# Altium schematic sheet GPSR_Peripheral.SchDoc: GPSR Front-End Board
size A3; CompanyName: NYCU; DocumentNumber: GPSR : Peripheral; Revision: v3.0; SheetNumber: 2; SheetTotal: 2; RevisionBy: Cheng-Chun Huang
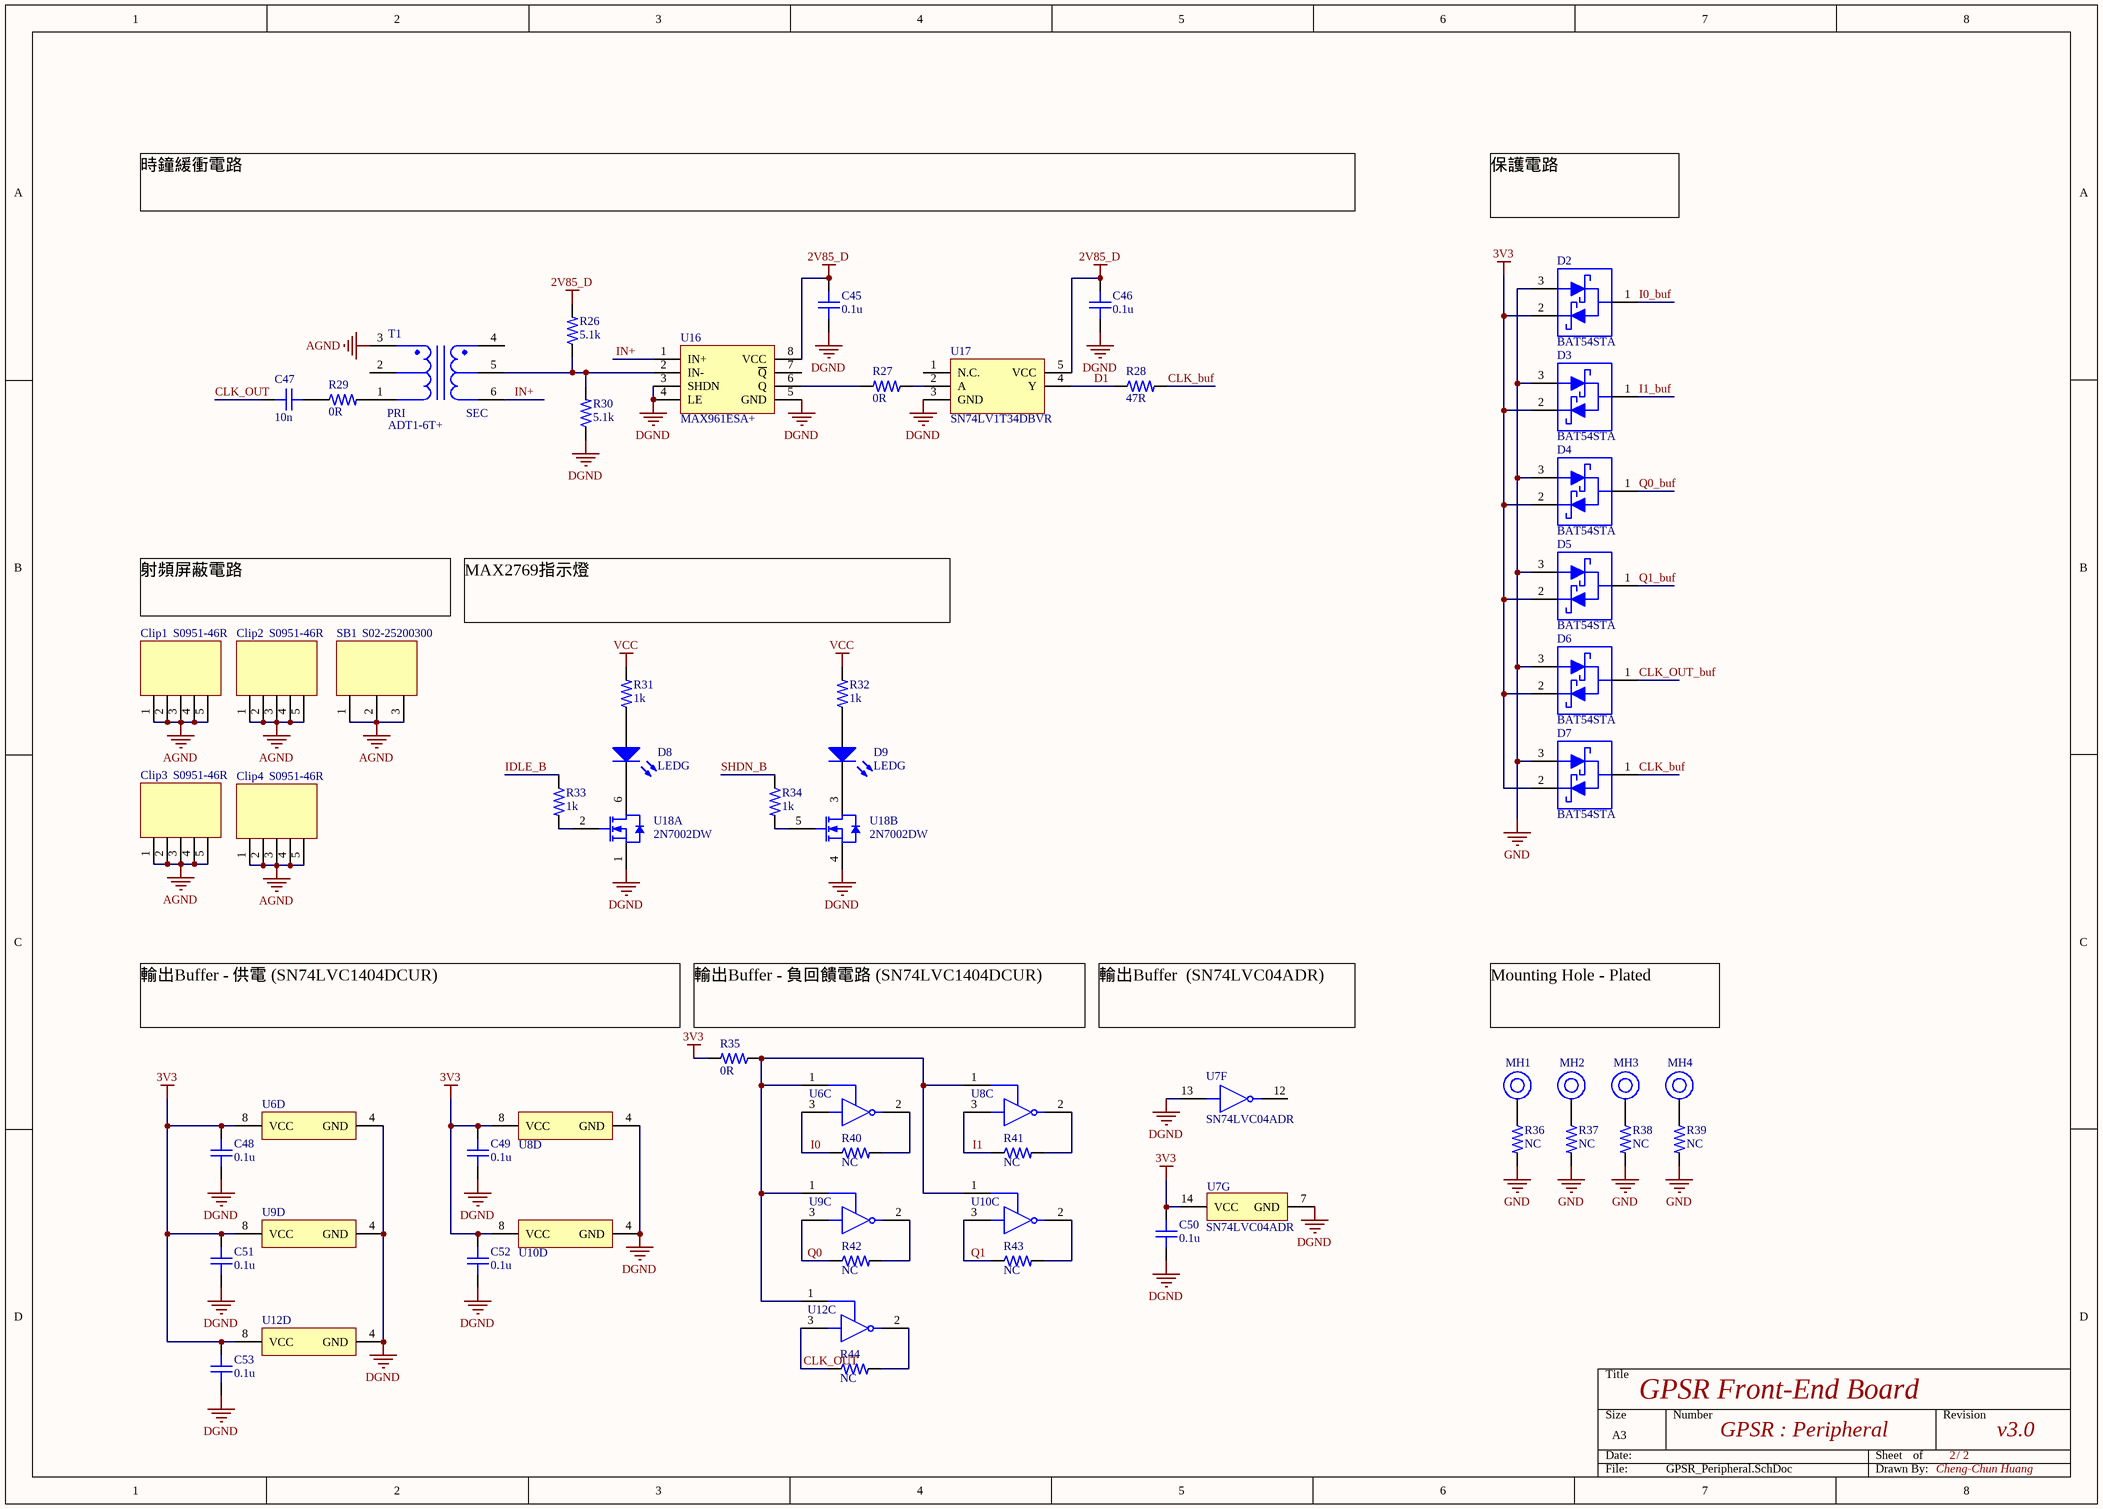
[diagram p0: GPSR_Peripheral.SchDoc]

## Parts
C45  value 0.1u  [C0603]  (hidden comment: 0.1uF)
C46  value 0.1u  [C0603]  (hidden comment: 0.1uF)
C47  value 10n  [C0603]  (hidden comment: 10nF)
C48  value 0.1u  [C0402]  (hidden comment: 0.1uF)
C49  value 0.1u  [C0402]  (hidden comment: 0.1uF)
C50  value 0.1u  [C0402]  (hidden comment: 0.1uF)
C51  value 0.1u  [C0402]  (hidden comment: 0.1uF)
C52  value 0.1u  [C0402]  (hidden comment: 0.1uF)
C53  value 0.1u  [C0402]  (hidden comment: 0.1uF)
Clip1  S0951-46R  [S095146R]
Clip2  S0951-46R  [S095146R]
Clip3  S0951-46R  [S095146R]
Clip4  S0951-46R  [S095146R]
D2  BAT54STA  [SOT96P240X115-3N]
D3  BAT54STA  [SOT96P240X115-3N]
D4  BAT54STA  [SOT96P240X115-3N]
D5  BAT54STA  [SOT96P240X115-3N]
D6  BAT54STA  [SOT96P240X115-3N]
D7  BAT54STA  [SOT96P240X115-3N]
D8  value LEDG  [D0603]  (hidden comment: D0603_LEDG)
D9  value LEDG  [D0603]  (hidden comment: D0603_LEDG)
MH1  MHP3.2mm  [MHP3.2mm]  (value not drawn)
MH2  MHP3.2mm  [MHP3.2mm]  (value not drawn)
MH3  MHP3.2mm  [MHP3.2mm]  (value not drawn)
MH4  MHP3.2mm  [MHP3.2mm]  (value not drawn)
R26  value 5.1k  [R0805]  (hidden comment: 5.1kΩ)
R27  value 0R  [R0805]  (hidden comment: 0Ω)
R28  value 47R  [R0805]  (hidden comment: 47Ω)
R29  value 0R  [R0805]  (hidden comment: 0Ω)
R30  value 5.1k  [R0805]  (hidden comment: 5.1kΩ)
R31  value 1k  [R0603]  (hidden comment: 1kΩ)
R32  value 1k  [R0603]  (hidden comment: 1kΩ)
R33  value 1k  [R0603]  (hidden comment: 1kΩ)
R34  value 1k  [R0603]  (hidden comment: 1kΩ)
R35  value 0R  [R0805]  (hidden comment: 0Ω)
R36  value NC  [R0805]  (hidden comment: No Connection)
R37  value NC  [R0805]  (hidden comment: No Connection)
R38  value NC  [R0805]  (hidden comment: No Connection)
R39  value NC  [R0805]  (hidden comment: No Connection)
R40  value NC  [R0805]  (hidden comment: No Connection)
R41  value NC  [R0805]  (hidden comment: No Connection)
R42  value NC  [R0805]  (hidden comment: No Connection)
R43  value NC  [R0805]  (hidden comment: No Connection)
R44  value NC  [R0805]  (hidden comment: No Connection)
SB1  S02-25200300  [S02-25200300]
T1  ADT1-6T+  [ADT16T]
U6  SN74LVC1404DCUR  [SOP50P310X90-8N]  (value not drawn)  (parts C,D of 4)
U7  SN74LVC04ADR  [SOIC127P600X175-14N]  (parts F,G of 7)
U8  SN74LVC1404DCUR  [SOP50P310X90-8N]  (value not drawn)  (parts C,D of 4)
U9  SN74LVC1404DCUR  [SOP50P310X90-8N]  (value not drawn)  (parts C,D of 4)
U10  SN74LVC1404DCUR  [SOP50P310X90-8N]  (value not drawn)  (parts C,D of 4)
U12  SN74LVC1404DCUR  [SOP50P310X90-8N]  (value not drawn)  (parts C,D of 4)
U16  MAX961ESA+  [SOIC127P600X175-8N]
U17  SN74LV1T34DBVR  [SOT95P280X145-5N]
U18  2N7002DW  [SOT65P210X110-6N]  (parts A,B of 2)

## Nets
2V85_D: C45.2 C46.2 R26.2 U16.8(VCC) U17.5(VCC)
3V3: C48.1 C49.1 C50.1 C51.1 C52.1 C53.1 D2.2(K) D3.2(K) D4.2(K) D5.2(K) D6.2(K) D7.2(K) R35.2 U6.8(VCC) U7.14(VCC) U8.8(VCC) U9.8(VCC) U10.8(VCC) U12.8(VCC)
AGND: Clip1.1 Clip1.2 Clip1.3 Clip1.4 Clip1.5 Clip2.1 Clip2.2 Clip2.3 Clip2.4 Clip2.5 Clip3.1 Clip3.2 Clip3.3 Clip3.4 Clip3.5 Clip4.1 Clip4.2 Clip4.3 Clip4.4 Clip4.5 SB1.1 SB1.2 SB1.3 T1.3(PRIMARY_DOT)
DGND: C45.1 C46.1 C48.2 C49.2 C50.2 C51.2 C52.2 C53.2 R30.1 U6.4(GND) U7.7(GND) U7.13(6A) U8.4(GND) U9.4(GND) U10.4(GND) U12.4(GND) U16.3(SHDN) U16.4(LE) U16.5(GND) U17.3(GND) U18.1(S1) U18.4(S2)
GND: D2.3(A) D3.3(A) D4.3(A) D5.3(A) D6.3(A) D7.3(A) R36.2 R37.2 R38.2 R39.2
VCC: R31.2 R32.2
CLK_buf: D7.1(K/A) R28.2
CLK_OUT: C47.1 R44.1 U12.3(XIN)
CLK_OUT_buf: D6.1(K/A)
D1: R28.1 U17.4(Y)
I0: R40.1 U6.3(XIN)
I0_buf: D2.1(K/A)
I1: R41.1 U8.3(XIN)
I1_buf: D3.1(K/A)
IDLE_B: R33.1
IN+: T1.6(SECONDARY) U16.1(IN+)
Q0: R42.1 U9.3(XIN)
Q0_buf: D4.1(K/A)
Q1: R43.1 U10.3(XIN)
Q1_buf: D5.1(K/A)
SHDN_B: R34.1
NetC47_2: C47.2 R29.1
NetD8_1: D8.1(A) R31.1
NetD8_2: D8.2(K) U18.6(D1)
NetD9_1: D9.1(A) R32.1
NetD9_2: D9.2(K) U18.3(D2)
NetMH1_1: MH1.1 R36.1
NetMH2_1: MH2.1 R37.1
NetMH3_1: MH3.1 R38.1
NetMH4_1: MH4.1 R39.1
NetR26_1: R26.1 R30.2 T1.5(SECONARY_CT) U16.2(IN-)
NetR27_1: R27.1 U17.2(A)
NetR27_2: R27.2 U16.6(Q)
NetR29_2: R29.2 T1.1(PRIMARY)
NetR33_2: R33.2 U18.2(G1)
NetR34_2: R34.2 U18.5(G2)
NetR35_1: R35.1 U6.1(CTRL) U8.1(CTRL) U9.1(CTRL) U10.1(CTRL) U12.1(CTRL)
NetR40_2: R40.2 U6.2(XOUT)
NetR41_2: R41.2 U8.2(XOUT)
NetR42_2: R42.2 U9.2(XOUT)
NetR43_2: R43.2 U10.2(XOUT)
NetR44_2: R44.2 U12.2(XOUT)

Not connected (* = marked no-connect by the designer): T1 2(NOT_USED) 4(SECONDARY_DOT); U7 12(6Y); U16 7(~{Q}); U17 1(N.C.)

## Notes on the sheet
- 時鐘緩衝電路
- 保護電路
- 射頻屏蔽電路
- MAX2769指示燈
- (near R35) 輸出Buffer - 供電 (SN74LVC1404DCUR)
- (near R35) 輸出Buffer - 負回饋電路 (SN74LVC1404DCUR)
- 輸出Buffer  (SN74LVC04ADR)
- Mounting Hole - Plated
- /
- (in symbol ADT1-6T+) PRI; SEC

## Library data of the parts
C45 C46 = C0603_0.1u: Capacitor
C47 = C0603_10n: Capacitor
C48-C53 = C0402_0.1u: Capacitor
Clip1-Clip4 = S0951-46R: EMI Gaskets, Sheets, Absorbers & Shielding EMC Shield Can Clip 0.20MM Thick Cans; Manufacturer_Name: Harwin; ComponentLink1Description: Datasheet Link; ComponentLink1URL: https://componentsearchengine.com/Datasheets/2/S0951-46R.pdf; Supplier 1: Mouser; Supplier Part Number 1: 855-S0951-46R; Manufacturer_Part_Number: S0951-46R
D2-D7 = BAT54STA: Schottky Diodes & Rectifiers Series 30V 200mA; Manufacturer_Name: Diodes Incorporated; Manufacturer_Part_Number: BAT54STA; Supplier 1: Mouser; ComponentLink1Description: Datasheet Link; ComponentLink1URL: https://www.mouser.tw/datasheet/2/115/DIODS12182_1-2541735.pdf; Supplier Part Number 1: 522-BAT54STA
D8 D9 = D0603_LEDG: LED, green
MH1-MH4 = MHP3.2mm: Mounting Hole Plated 3.2mm
R26 R30 = R0805_5.1k: Resistor
R27 R29 R35 = R0805_0R: Resistor
R28 = R0805_47R: Resistor
R31-R34 = R0603_1k: Resistor
R36-R44 = R0805_NC: Resistor
SB1 = S02-25200300: EMI Gaskets, Sheets, Absorbers & Shielding EMC Shield Can .2mm thick, 25X20X03; Manufacturer_Name: Harwin; ComponentLink1Description: Datasheet Link; ComponentLink1URL: https://www.mouser.tw/datasheet/2/181/S02_XXXXXXX0-1273990.pdf; Supplier 1: Mouser; Supplier Part Number 1: 855-S02-25200300; Manufacturer_Part_Number: S02-25200300
T1 = ADT1-6T+: Audio Transformers / Signal Transformers RF XFMR / SURF MOUNT / RoHS; Manufacturer_Name: Mini-Circuits; Manufacturer_Part_Number: ADT1-6T+; ComponentLink1Description: Datasheet Link; ComponentLink1URL: https://www.mouser.tw/datasheet/2/1030/ADT1-6T_2b-1700294.pdf; Supplier 1: Mouser; Supplier Part Number 1: 139-ADT1-6T
U6 U8-U10 U12 = SN74LVC1404DCUR: 2-ch, 1.65-V to 5.5-V inverters with Schmitt-Trigger inputs; Manufacturer_Name: Texas Instruments; ComponentLink1Description: Datasheet Link; ComponentLink1URL: http://www.ti.com/lit/gpn/sn74lvc1404; Supplier 1: Mouser; Supplier Part Number 1: 595-SN74LVC1404DCUR; Manufacturer_Part_Number: SN74LVC1404DCUR
U7 = SN74LVC04ADR: Inverters Hex; Manufacturer_Name: Texas Instruments; ComponentLink1Description: Datasheet Link; ComponentLink1URL: http://www.ti.com/lit/gpn/sn74lvc04a; Supplier 1: Mouser; Supplier Part Number 1: 595-SN74LVC04ADR; Manufacturer_Part_Number: SN74LVC04ADR
U16 = MAX961ESA+: Analog Comparators Single/Dual/Quad, Ultra-High-Speed, +3V; Manufacturer_Name: Analog Devices / Maxim Integrated; Manufacturer_Part_Number: MAX961ESA+; ComponentLink1Description: Datasheet Link; ComponentLink1URL: http://datasheets.maximintegrated.com/en/ds/MAX961-MAX999.pdf; Supplier 1: Mouser; Supplier Part Number 1: 700-MAX961ESA
U17 = SN74LV1T34DBVR: Translation - Voltage Levels SGL Pwr Spply Buffer GATE CMOS; Manufacturer_Name: Texas Instruments; ComponentLink1Description: Datasheet Link; ComponentLink1URL: http://www.ti.com/lit/gpn/sn74lv1t34; Supplier 1: Mouser; Supplier Part Number 1: 595-SN74LV1T34DBVR; Manufacturer_Part_Number: SN74LV1T34DBVR
U18 = 2N7002DW: MOSFETs N-Chan Enhancement Mode Field Effect; Manufacturer_Name: onsemi; ComponentLink1Description: Datasheet Link; ComponentLink1URL: https://datasheet.datasheetarchive.com/originals/distributors/Datasheets_SAMA/951ecc1ab16cbf3d5524c3c8fb4b034a.pdf; Supplier 1: Mouser; Supplier Part Number 1: 512-2N7002W; Manufacturer_Part_Number: 2N7002DW